# Altium project Sayma_AMC.PrjPcb (part 17 of 18)
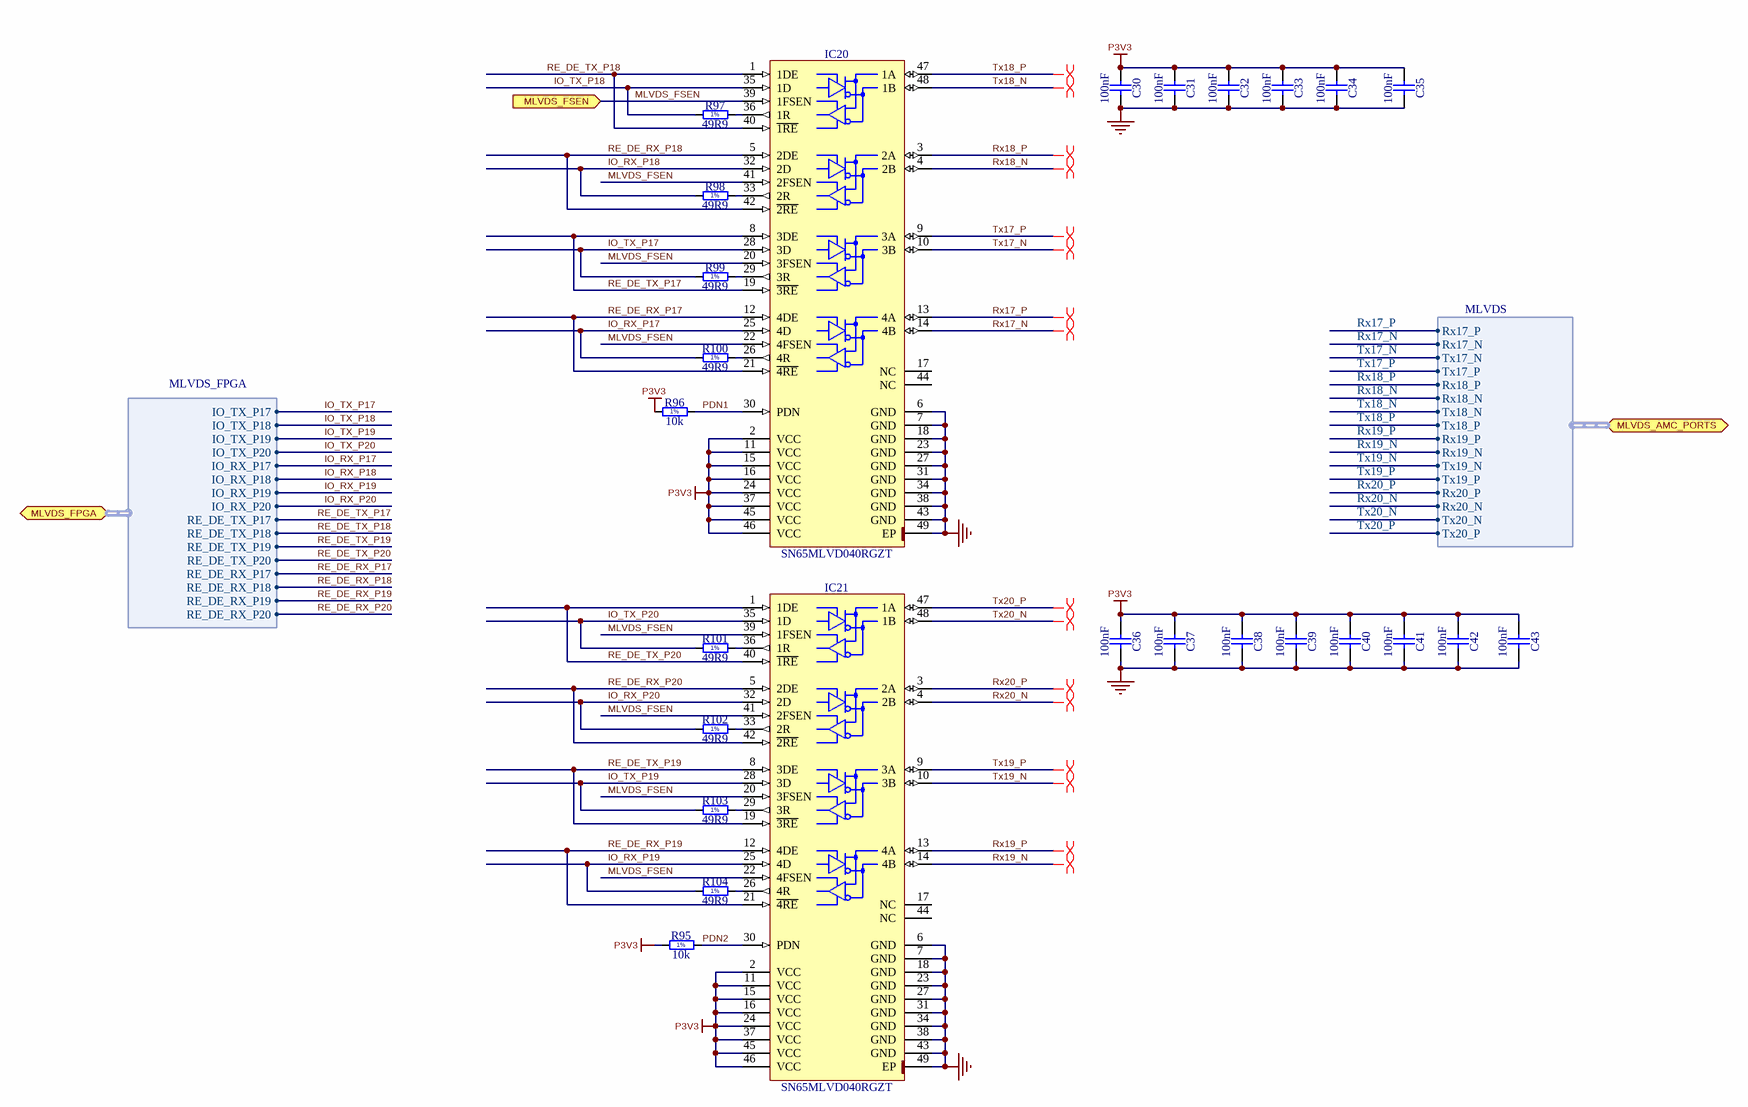
[diagram p32: M-LVDS_PHY.SchDoc]
## Nets that join several sheets
GND: Sayma_AMC (38 pins), USB_SERIAL_QUAD (51 pins), AMC_Connector (56 pins), SDRAM_DDR3_4x16 (177 pins), JTAG_Configuration (32 pins), FMC_connector (175 pins), SDRAM_DDR3_2x16 (101 pins), POWER_Management (39 pins), PWR_DC_DC_EXAR (57 pins), QUAD_BUCK (40 pins), PWR_0V9_20A (24 pins), RTM_CON (61 pins), SFP (28 pins), ETH_PHY_RGMII (33 pins), SI5324_CDR_WR_oscillators (80 pins), DDMTD (13 pins), I2C_MUX (7 pins), Thermometers (23 pins), CPU_LPC1776 (18 pins), DUAL_IO_TTL_BUFFER (6 pins), SFP (28 pins), CPU_LPC1776_SUP_PROG (41 pins), FPGA_Banks_44_45_46_DDR64 (7 pins), FPGA_Banks_47_48_HP_FMC (6 pins), FPGA_Banks_64_65_HR (5 pins), FPGA_Banks_67_68_DDR32 (R319.1 R320.1), FPGA_Bank_0_CFG (27 pins), FPGA_Decoupling (124 pins), FPGA_GND_NC (271 pins), FPGA_Bank_66_HP (R323.1), FPGA_Power (18 pins), FPGA_Banks_224_225_226_227_228 (20 pins), M-LVDS_PHY (34 pins)
MGTAVCC: PWR_DC_DC_EXAR (L27.2 L32.2), FPGA_Decoupling (27 pins), FPGA_Power (14 pins)
MGTAVTT: PWR_DC_DC_EXAR (L26.2), FPGA_Bank_0_CFG (IC37.AP6 R527.2), FPGA_Decoupling (22 pins), FPGA_Power (16 pins)
MGTVCCAUX: PWR_DC_DC_EXAR (L24.1), FPGA_Decoupling (5 pins), FPGA_Power (IC37.AA6 IC37.R6)
P1V5: SDRAM_DDR3_4x16 (131 pins), SDRAM_DDR3_2x16 (67 pins), PWR_DC_DC_EXAR (5 pins), FPGA_Banks_44_45_46_DDR64 (R260.1 R261.1 R262.1 R263.1), FPGA_Decoupling (13 pins), FPGA_Power (33 pins)
P1V8: FMC_connector (7 pins), PWR_DC_DC_EXAR (6 pins), FPGA_Banks_47_48_HP_FMC (R290.1), FPGA_Bank_0_CFG (R575.1), FPGA_Decoupling (8 pins), FPGA_Power (21 pins)
P3V3: USB_SERIAL_QUAD (7 pins), SDRAM_DDR3_4x16 (C431.1 IC28.7 IC28.10), JTAG_Configuration (17 pins), SDRAM_DDR3_2x16 (C444.1 IC29.7 IC29.10), POWER_Management (R524.1), PWR_DC_DC_EXAR (L28.2 L34.2 R506.2 TP11.1), SFP (16 pins), ETH_PHY_RGMII (9 pins), SI5324_CDR_WR_oscillators (R313.1 R381.1), I2C_MUX (13 pins), DUAL_IO_TTL_BUFFER (C402.1 IC52.14 R448.2 R449.2), SFP (16 pins), FPGA_Banks_64_65_HR (C258.2 J18.11 OSC3.1 OSC3.4), FPGA_Bank_0_CFG (21 pins), FPGA_Decoupling (7 pins), FPGA_Power (15 pins), FPGA_Banks_224_225_226_227_228 (L14.2 L15.2), M-LVDS_PHY (32 pins)
P3V3_CLK: SI5324_CDR_WR_oscillators (7 pins), DDMTD (L7.1)
P3V3_FMC: FMC_connector (6 pins), PWR_DC_DC_EXAR (6 pins)
P3V3MP: USB_SERIAL_QUAD (IC8.1 R517.1 R518.2), AMC_Connector (J5.4), JTAG_Configuration (5 pins), POWER_Management (15 pins), PWR_DC_DC_EXAR (7 pins), QUAD_BUCK (R557.2), PWR_0V9_20A (R512.2), I2C_MUX (8 pins), Thermometers (20 pins), CPU_LPC1776 (27 pins), CPU_LPC1776_SUP_PROG (39 pins), FPGA_Bank_0_CFG (C216.2 IC35.14)
P3V3MP_RTM: POWER_Management (F2.2), RTM_CON (J11.c2)
P5V0: PWR_DC_DC_EXAR (8 pins), QUAD_BUCK (R556.2), SI5324_CDR_WR_oscillators (L17.1)
P12V0: POWER_Management (22 pins), PWR_DC_DC_EXAR (11 pins), QUAD_BUCK (10 pins), PWR_0V9_20A (15 pins)
P12V0_RTM: POWER_Management (IC56.2 R86.2 R523.2), RTM_CON (J11.a1 J11.a2 J11.b1 J11.b2)
PAYLOAD_PWR: AMC_Connector (8 pins), POWER_Management (5 pins)
VCCAUX: PWR_DC_DC_EXAR (L30.2), FPGA_Decoupling (6 pins), FPGA_Power (15 pins)
VCCBRAM: PWR_DC_DC_EXAR (L25.2 R554.2), FPGA_Decoupling (10 pins), FPGA_Power (IC37.AA18 IC37.AB17 IC37.V17 IC37.Y17)
VCCINT: PWR_DC_DC_EXAR (R554.1 TP13.1), PWR_0V9_20A (R187.2 R507.1 R515.1 R536.2), FPGA_Decoupling (26 pins), FPGA_Power (49 pins)
VTT32: SDRAM_DDR3_2x16 (43 pins), FPGA_Banks_67_68_DDR32 (6 pins)
VTT64: SDRAM_DDR3_4x16 (43 pins), FPGA_Banks_44_45_46_DDR64 (12 pins)
AMC_En: AMC_Connector (J5.41), CPU_LPC1776 (R404.1 R414.1), CPU_LPC1776_SUP_PROG (D29.1 R434.1 T18.1)
AMC_TCK: AMC_Connector (J5.165), JTAG_Configuration (D18.1 IC5.9 R57.2)
AMC_TDI: AMC_Connector (J5.169), JTAG_Configuration (D16.1 IC5.4 R56.2)
AMC_TDO: AMC_Connector (J5.168), JTAG_Configuration (D19.1 IC5.7 R55.2)
AMC_TMS: AMC_Connector (J5.166), JTAG_Configuration (D17.1 IC5.12 R54.2)
AMC_TRSTn: AMC_Connector (J5.167), JTAG_Configuration (D4.1 D22.1 R47.2 R63.2)
ARX0_N: ETH_PHY_RGMII (C183.2), FPGA_Banks_224_225_226_227_228 (C335.2)
ARX0_P: ETH_PHY_RGMII (C182.2), FPGA_Banks_224_225_226_227_228 (C336.2)
ATX0_N: ETH_PHY_RGMII (C185.2), FPGA_Banks_224_225_226_227_228 (C333.2)
ATX0_P: ETH_PHY_RGMII (C184.2), FPGA_Banks_224_225_226_227_228 (C334.2)
AUX_UART_RxD: USB_SERIAL_QUAD (R16.1), FPGA_Banks_64_65_HR (IC37.L27)
AUX_UART_TxD: USB_SERIAL_QUAD (R15.1), FPGA_Banks_64_65_HR (IC37.M27)
BOOT_MODE0: CPU_LPC1776 (IC51.P9), FPGA_Bank_0_CFG (R248.2)
BOOT_MODE1: CPU_LPC1776 (IC51.P11), FPGA_Bank_0_CFG (R247.2)
BOOT_MODE2: CPU_LPC1776 (IC51.P3), FPGA_Bank_0_CFG (R246.2)
BOOT_MODE3: CPU_LPC1776 (IC51.N5), FPGA_Bank_0_CFG (R251.2)
CDR_CLK_CLEAN0_N: SI5324_CDR_WR_oscillators (C358.2), FPGA_Bank_66_HP (IC37.G12 R325.2)
CDR_CLK_CLEAN0_P: SI5324_CDR_WR_oscillators (C362.2), FPGA_Bank_66_HP (IC37.H12 R324.2)
CDR_CLK_CLEAN1_N: SI5324_CDR_WR_oscillators (C359.2), FPGA_Banks_224_225_226_227_228 (IC37.AF5)
CDR_CLK_CLEAN1_P: SI5324_CDR_WR_oscillators (C361.2), FPGA_Banks_224_225_226_227_228 (IC37.AF6)
CDR_CLK_CLEAN2_N: SI5324_CDR_WR_oscillators (C274.2), FPGA_Banks_224_225_226_227_228 (IC37.Y5)
CDR_CLK_CLEAN2_P: SI5324_CDR_WR_oscillators (C1.2), FPGA_Banks_224_225_226_227_228 (IC37.Y6)
CDR_CLK_CLEAN3_N: SI5324_CDR_WR_oscillators (C448.2), FPGA_Banks_224_225_226_227_228 (IC37.P5)
CDR_CLK_CLEAN3_P: SI5324_CDR_WR_oscillators (C407.2), FPGA_Banks_224_225_226_227_228 (IC37.P6)
CLK0_M2C_N: FMC_connector (J8.h5), FPGA_Banks_47_48_HP_FMC (IC37.AA25)
CLK0_M2C_P: FMC_connector (J8.h4), FPGA_Banks_47_48_HP_FMC (IC37.AA24)
CLK1_M2C_N: FMC_connector (J8.g3), FPGA_Banks_47_48_HP_FMC (IC37.AC32)
CLK1_M2C_P: FMC_connector (J8.g2), FPGA_Banks_47_48_HP_FMC (IC37.AC31)
CLK_DIR: FMC_connector (J8.b1), CPU_LPC1776 (R438.1 R439.1)
CLK_SEL: SI5324_CDR_WR_oscillators (IC44.32), FPGA_Banks_64_65_HR (IC37.N23)
DDMTD_OUT_CDR_CLK_N: DDMTD (R345.2 R539.1), FPGA_Banks_67_68_DDR32 (IC37.B16 R543.2 R544.2)
DDMTD_OUT_CDR_CLK_P: DDMTD (R344.2 R538.2), FPGA_Banks_67_68_DDR32 (IC37.B17 R542.2 R543.1)
DDMTD_OUT_CDR_CLK_SSTL18: DDMTD (C674.1 R569.1 R570.2), FPGA_Bank_66_HP (IC37.F12)
DDMTD_OUT_MAIN_CLK_N: DDMTD (R526.2 R541.1), FPGA_Banks_67_68_DDR32 (IC37.A15 R546.2 R547.2)
DDMTD_OUT_MAIN_CLK_P: DDMTD (R494.2 R540.2), FPGA_Banks_67_68_DDR32 (IC37.B15 R545.2 R546.1)
DDMTD_OUT_MAIN_CLK_SSTL18: DDMTD (C675.1 R573.1 R574.2), FPGA_Bank_66_HP (IC37.L9)
DDR3_32_A0: SDRAM_DDR3_2x16 (IC26.N3 IC27.N3 R164.2), FPGA_Banks_67_68_DDR32 (IC37.E15)
DDR3_32_A1: SDRAM_DDR3_2x16 (IC26.P7 IC27.P7 R163.2), FPGA_Banks_67_68_DDR32 (IC37.D15)
DDR3_32_A2: SDRAM_DDR3_2x16 (IC26.P3 IC27.P3 R162.2), FPGA_Banks_67_68_DDR32 (IC37.J16)
DDR3_32_A3: SDRAM_DDR3_2x16 (IC26.N2 IC27.N2 R168.2), FPGA_Banks_67_68_DDR32 (IC37.K18)
DDR3_32_A4: SDRAM_DDR3_2x16 (IC26.P8 IC27.P8 R167.2), FPGA_Banks_67_68_DDR32 (IC37.H16)
DDR3_32_A5: SDRAM_DDR3_2x16 (IC26.P2 IC27.P2 R166.2), FPGA_Banks_67_68_DDR32 (IC37.K17)
DDR3_32_A6: SDRAM_DDR3_2x16 (IC26.R8 IC27.R8 R165.2), FPGA_Banks_67_68_DDR32 (IC37.K16)
DDR3_32_A7: SDRAM_DDR3_2x16 (IC26.R2 IC27.R2 R161.2), FPGA_Banks_67_68_DDR32 (IC37.J15)
DDR3_32_A8: SDRAM_DDR3_2x16 (IC26.T8 IC27.T8 R160.2), FPGA_Banks_67_68_DDR32 (IC37.K15)
DDR3_32_A9: SDRAM_DDR3_2x16 (IC26.R3 IC27.R3 R159.2), FPGA_Banks_67_68_DDR32 (IC37.D14)
DDR3_32_A10: SDRAM_DDR3_2x16 (IC26.L7 IC27.L7 R158.2), FPGA_Banks_67_68_DDR32 (IC37.D18)
DDR3_32_A11: SDRAM_DDR3_2x16 (IC26.R7 IC27.R7 R157.2), FPGA_Banks_67_68_DDR32 (IC37.G15)
DDR3_32_A12: SDRAM_DDR3_2x16 (IC26.N7 IC27.N7 R156.2), FPGA_Banks_67_68_DDR32 (IC37.L18)
DDR3_32_A13: SDRAM_DDR3_2x16 (IC26.T3 IC27.T3 R155.2), FPGA_Banks_67_68_DDR32 (IC37.G14)
DDR3_32_A14: SDRAM_DDR3_2x16 (IC26.T7 IC27.T7 R170.2), FPGA_Banks_67_68_DDR32 (IC37.L15)
DDR3_32_BA0: SDRAM_DDR3_2x16 (IC26.M2 IC27.M2 R146.2), FPGA_Banks_67_68_DDR32 (IC37.L19)
DDR3_32_BA1: SDRAM_DDR3_2x16 (IC26.N8 IC27.N8 R145.2), FPGA_Banks_67_68_DDR32 (IC37.H17)
DDR3_32_BA2: SDRAM_DDR3_2x16 (IC26.M3 IC27.M3 R144.2), FPGA_Banks_67_68_DDR32 (IC37.G16)
DDR3_32_CAS_N: SDRAM_DDR3_2x16 (IC26.K3 IC27.K3 R150.2), FPGA_Banks_67_68_DDR32 (IC37.E16)
DDR3_32_CK_N: SDRAM_DDR3_2x16 (IC26.K7 IC27.K7 R153.2), FPGA_Banks_67_68_DDR32 (IC37.J18)
DDR3_32_CK_P: SDRAM_DDR3_2x16 (IC26.J7 IC27.J7 R154.2), FPGA_Banks_67_68_DDR32 (IC37.J19)
DDR3_32_CKE: SDRAM_DDR3_2x16 (IC26.K9 IC27.K9 R152.2), FPGA_Banks_67_68_DDR32 (IC37.H18)
DDR3_32_CS_N: SDRAM_DDR3_2x16 (IC26.L2 IC27.L2 R149.2), FPGA_Banks_67_68_DDR32 (IC37.G19)
DDR3_32_DM0: SDRAM_DDR3_2x16 (IC26.E7), FPGA_Banks_67_68_DDR32 (IC37.F27)
DDR3_32_DM1: SDRAM_DDR3_2x16 (IC26.D3), FPGA_Banks_67_68_DDR32 (IC37.E26)
DDR3_32_DM2: SDRAM_DDR3_2x16 (IC27.E7), FPGA_Banks_67_68_DDR32 (IC37.D23)
DDR3_32_DM3: SDRAM_DDR3_2x16 (IC27.D3), FPGA_Banks_67_68_DDR32 (IC37.G24)
DDR3_32_DQ0: SDRAM_DDR3_2x16 (IC26.E3), FPGA_Banks_67_68_DDR32 (IC37.C28)
DDR3_32_DQ1: SDRAM_DDR3_2x16 (IC26.F7), FPGA_Banks_67_68_DDR32 (IC37.B27)
DDR3_32_DQ2: SDRAM_DDR3_2x16 (IC26.F2), FPGA_Banks_67_68_DDR32 (IC37.A27)
DDR3_32_DQ3: SDRAM_DDR3_2x16 (IC26.F8), FPGA_Banks_67_68_DDR32 (IC37.C27)
DDR3_32_DQ4: SDRAM_DDR3_2x16 (IC26.H3), FPGA_Banks_67_68_DDR32 (IC37.D28)
DDR3_32_DQ5: SDRAM_DDR3_2x16 (IC26.H8), FPGA_Banks_67_68_DDR32 (IC37.E28)
DDR3_32_DQ6: SDRAM_DDR3_2x16 (IC26.G2), FPGA_Banks_67_68_DDR32 (IC37.A28)
DDR3_32_DQ7: SDRAM_DDR3_2x16 (IC26.H7), FPGA_Banks_67_68_DDR32 (IC37.D29)
DDR3_32_DQ8: SDRAM_DDR3_2x16 (IC26.D7), FPGA_Banks_67_68_DDR32 (IC37.D25)
DDR3_32_DQ9: SDRAM_DDR3_2x16 (IC26.C3), FPGA_Banks_67_68_DDR32 (IC37.C26)
DDR3_32_DQ10: SDRAM_DDR3_2x16 (IC26.C8), FPGA_Banks_67_68_DDR32 (IC37.E25)
DDR3_32_DQ11: SDRAM_DDR3_2x16 (IC26.C2), FPGA_Banks_67_68_DDR32 (IC37.B25)
DDR3_32_DQ12: SDRAM_DDR3_2x16 (IC26.A7), FPGA_Banks_67_68_DDR32 (IC37.C24)
DDR3_32_DQ13: SDRAM_DDR3_2x16 (IC26.A2), FPGA_Banks_67_68_DDR32 (IC37.A25)
DDR3_32_DQ14: SDRAM_DDR3_2x16 (IC26.B8), FPGA_Banks_67_68_DDR32 (IC37.D24)
DDR3_32_DQ15: SDRAM_DDR3_2x16 (IC26.A3), FPGA_Banks_67_68_DDR32 (IC37.B26)
DDR3_32_DQ16: SDRAM_DDR3_2x16 (IC27.E3), FPGA_Banks_67_68_DDR32 (IC37.B20)
DDR3_32_DQ17: SDRAM_DDR3_2x16 (IC27.F7), FPGA_Banks_67_68_DDR32 (IC37.D21)
DDR3_32_DQ18: SDRAM_DDR3_2x16 (IC27.F2), FPGA_Banks_67_68_DDR32 (IC37.B22)
DDR3_32_DQ19: SDRAM_DDR3_2x16 (IC27.F8), FPGA_Banks_67_68_DDR32 (IC37.E23)
DDR3_32_DQ20: SDRAM_DDR3_2x16 (IC27.H3), FPGA_Banks_67_68_DDR32 (IC37.E22)
DDR3_32_DQ21: SDRAM_DDR3_2x16 (IC27.H8), FPGA_Banks_67_68_DDR32 (IC37.D20)
DDR3_32_DQ22: SDRAM_DDR3_2x16 (IC27.G2), FPGA_Banks_67_68_DDR32 (IC37.B21)
DDR3_32_DQ23: SDRAM_DDR3_2x16 (IC27.H7), FPGA_Banks_67_68_DDR32 (IC37.A20)
DDR3_32_DQ24: SDRAM_DDR3_2x16 (IC27.D7), FPGA_Banks_67_68_DDR32 (IC37.F23)
DDR3_32_DQ25: SDRAM_DDR3_2x16 (IC27.C3), FPGA_Banks_67_68_DDR32 (IC37.H21)
DDR3_32_DQ26: SDRAM_DDR3_2x16 (IC27.C8), FPGA_Banks_67_68_DDR32 (IC37.F24)
DDR3_32_DQ27: SDRAM_DDR3_2x16 (IC27.C2), FPGA_Banks_67_68_DDR32 (IC37.G21)
DDR3_32_DQ28: SDRAM_DDR3_2x16 (IC27.A7), FPGA_Banks_67_68_DDR32 (IC37.F22)
DDR3_32_DQ29: SDRAM_DDR3_2x16 (IC27.A2), FPGA_Banks_67_68_DDR32 (IC37.E21)
DDR3_32_DQ30: SDRAM_DDR3_2x16 (IC27.B8), FPGA_Banks_67_68_DDR32 (IC37.G22)
DDR3_32_DQ31: SDRAM_DDR3_2x16 (IC27.A3), FPGA_Banks_67_68_DDR32 (IC37.E20)
DDR3_32_DQS0_N: SDRAM_DDR3_2x16 (IC26.G3), FPGA_Banks_67_68_DDR32 (IC37.A29)
DDR3_32_DQS0_P: SDRAM_DDR3_2x16 (IC26.F3), FPGA_Banks_67_68_DDR32 (IC37.B29)
DDR3_32_DQS1_N: SDRAM_DDR3_2x16 (IC26.B7), FPGA_Banks_67_68_DDR32 (IC37.A24)
DDR3_32_DQS1_P: SDRAM_DDR3_2x16 (IC26.C7), FPGA_Banks_67_68_DDR32 (IC37.B24)
DDR3_32_DQS2_N: SDRAM_DDR3_2x16 (IC27.G3), FPGA_Banks_67_68_DDR32 (IC37.C22)
DDR3_32_DQS2_P: SDRAM_DDR3_2x16 (IC27.F3), FPGA_Banks_67_68_DDR32 (IC37.C21)
DDR3_32_DQS3_N: SDRAM_DDR3_2x16 (IC27.B7), FPGA_Banks_67_68_DDR32 (IC37.F20)
DDR3_32_DQS3_P: SDRAM_DDR3_2x16 (IC27.C7), FPGA_Banks_67_68_DDR32 (IC37.G20)
DDR3_32_ODT: SDRAM_DDR3_2x16 (IC26.K1 IC27.K1 R147.2), FPGA_Banks_67_68_DDR32 (IC37.F19)
DDR3_32_RAS_N: SDRAM_DDR3_2x16 (IC26.J3 IC27.J3 R151.2), FPGA_Banks_67_68_DDR32 (IC37.E18)
DDR3_32_RST_N: SDRAM_DDR3_2x16 (IC26.T2 IC27.T2 R169.2), FPGA_Banks_67_68_DDR32 (IC37.F14)
DDR3_32_WE_N: SDRAM_DDR3_2x16 (IC26.L3 IC27.L3 R148.2), FPGA_Banks_67_68_DDR32 (IC37.D16)
DDR3_64_A0: SDRAM_DDR3_4x16 (5 pins), FPGA_Banks_44_45_46_DDR64 (IC37.AE17)
DDR3_64_A1: SDRAM_DDR3_4x16 (5 pins), FPGA_Banks_44_45_46_DDR64 (IC37.AL17)
DDR3_64_A2: SDRAM_DDR3_4x16 (5 pins), FPGA_Banks_44_45_46_DDR64 (IC37.AG16)
DDR3_64_A3: SDRAM_DDR3_4x16 (5 pins), FPGA_Banks_44_45_46_DDR64 (IC37.AG17)
DDR3_64_A4: SDRAM_DDR3_4x16 (5 pins), FPGA_Banks_44_45_46_DDR64 (IC37.AD16)
DDR3_64_A5: SDRAM_DDR3_4x16 (5 pins), FPGA_Banks_44_45_46_DDR64 (IC37.AH14)
DDR3_64_A6: SDRAM_DDR3_4x16 (5 pins), FPGA_Banks_44_45_46_DDR64 (IC37.AD15)
DDR3_64_A7: SDRAM_DDR3_4x16 (5 pins), FPGA_Banks_44_45_46_DDR64 (IC37.AK15)
DDR3_64_A8: SDRAM_DDR3_4x16 (5 pins), FPGA_Banks_44_45_46_DDR64 (IC37.AF14)
DDR3_64_A9: SDRAM_DDR3_4x16 (5 pins), FPGA_Banks_44_45_46_DDR64 (IC37.AF15)
DDR3_64_A10: SDRAM_DDR3_4x16 (5 pins), FPGA_Banks_44_45_46_DDR64 (IC37.AL18)
DDR3_64_A11: SDRAM_DDR3_4x16 (5 pins), FPGA_Banks_44_45_46_DDR64 (IC37.AL15)
DDR3_64_A12: SDRAM_DDR3_4x16 (5 pins), FPGA_Banks_44_45_46_DDR64 (IC37.AE18)
DDR3_64_A13: SDRAM_DDR3_4x16 (5 pins), FPGA_Banks_44_45_46_DDR64 (IC37.AJ15)
DDR3_64_A14: SDRAM_DDR3_4x16 (5 pins), FPGA_Banks_44_45_46_DDR64 (IC37.AG14)
DDR3_64_BA0: SDRAM_DDR3_4x16 (5 pins), FPGA_Banks_44_45_46_DDR64 (IC37.AF17)
DDR3_64_BA1: SDRAM_DDR3_4x16 (5 pins), FPGA_Banks_44_45_46_DDR64 (IC37.AD19)
DDR3_64_BA2: SDRAM_DDR3_4x16 (5 pins), FPGA_Banks_44_45_46_DDR64 (IC37.AD18)
DDR3_64_CAS_N: SDRAM_DDR3_4x16 (5 pins), FPGA_Banks_44_45_46_DDR64 (IC37.AK18)
DDR3_64_CK_N: SDRAM_DDR3_4x16 (5 pins), FPGA_Banks_44_45_46_DDR64 (IC37.AE15)
DDR3_64_CK_P: SDRAM_DDR3_4x16 (5 pins), FPGA_Banks_44_45_46_DDR64 (IC37.AE16)
DDR3_64_CKE: SDRAM_DDR3_4x16 (5 pins), FPGA_Banks_44_45_46_DDR64 (IC37.AL19)
DDR3_64_CS_N: SDRAM_DDR3_4x16 (5 pins), FPGA_Banks_44_45_46_DDR64 (IC37.AF18)
DDR3_64_DM0: SDRAM_DDR3_4x16 (IC22.E7), FPGA_Banks_44_45_46_DDR64 (IC37.AD21)
DDR3_64_DM1: SDRAM_DDR3_4x16 (IC22.D3), FPGA_Banks_44_45_46_DDR64 (IC37.AE25)
DDR3_64_DM2: SDRAM_DDR3_4x16 (IC23.E7), FPGA_Banks_44_45_46_DDR64 (IC37.AJ21)
DDR3_64_DM3: SDRAM_DDR3_4x16 (IC23.D3), FPGA_Banks_44_45_46_DDR64 (IC37.AM21)
DDR3_64_DM4: SDRAM_DDR3_4x16 (IC4.E7), FPGA_Banks_44_45_46_DDR64 (IC37.AH26)
DDR3_64_DM5: SDRAM_DDR3_4x16 (IC4.D3), FPGA_Banks_44_45_46_DDR64 (IC37.AN26)
DDR3_64_DM6: SDRAM_DDR3_4x16 (IC25.E7), FPGA_Banks_44_45_46_DDR64 (IC37.AJ29)
DDR3_64_DM7: SDRAM_DDR3_4x16 (IC25.D3), FPGA_Banks_44_45_46_DDR64 (IC37.AL32)
DDR3_64_DQ0: SDRAM_DDR3_4x16 (IC22.E3), FPGA_Banks_44_45_46_DDR64 (IC37.AE23)
DDR3_64_DQ1: SDRAM_DDR3_4x16 (IC22.F7), FPGA_Banks_44_45_46_DDR64 (IC37.AG20)
DDR3_64_DQ2: SDRAM_DDR3_4x16 (IC22.F2), FPGA_Banks_44_45_46_DDR64 (IC37.AF22)
DDR3_64_DQ3: SDRAM_DDR3_4x16 (IC22.F8), FPGA_Banks_44_45_46_DDR64 (IC37.AF20)
DDR3_64_DQ4: SDRAM_DDR3_4x16 (IC22.H3), FPGA_Banks_44_45_46_DDR64 (IC37.AE22)
DDR3_64_DQ5: SDRAM_DDR3_4x16 (IC22.H8), FPGA_Banks_44_45_46_DDR64 (IC37.AD20)
DDR3_64_DQ6: SDRAM_DDR3_4x16 (IC22.G2), FPGA_Banks_44_45_46_DDR64 (IC37.AG22)
DDR3_64_DQ7: SDRAM_DDR3_4x16 (IC22.H7), FPGA_Banks_44_45_46_DDR64 (IC37.AE20)
DDR3_64_DQ8: SDRAM_DDR3_4x16 (IC22.D7), FPGA_Banks_44_45_46_DDR64 (IC37.AJ24)
DDR3_64_DQ9: SDRAM_DDR3_4x16 (IC22.C3), FPGA_Banks_44_45_46_DDR64 (IC37.AG24)
DDR3_64_DQ10: SDRAM_DDR3_4x16 (IC22.C8), FPGA_Banks_44_45_46_DDR64 (IC37.AJ23)
DDR3_64_DQ11: SDRAM_DDR3_4x16 (IC22.C2), FPGA_Banks_44_45_46_DDR64 (IC37.AF23)
DDR3_64_DQ12: SDRAM_DDR3_4x16 (IC22.A7), FPGA_Banks_44_45_46_DDR64 (IC37.AH23)
DDR3_64_DQ13: SDRAM_DDR3_4x16 (IC22.A2), FPGA_Banks_44_45_46_DDR64 (IC37.AF24)
DDR3_64_DQ14: SDRAM_DDR3_4x16 (IC22.B8), FPGA_Banks_44_45_46_DDR64 (IC37.AH22)
DDR3_64_DQ15: SDRAM_DDR3_4x16 (IC22.A3), FPGA_Banks_44_45_46_DDR64 (IC37.AG25)
DDR3_64_DQ16: SDRAM_DDR3_4x16 (IC23.E3), FPGA_Banks_44_45_46_DDR64 (IC37.AL22)
DDR3_64_DQ17: SDRAM_DDR3_4x16 (IC23.F7), FPGA_Banks_44_45_46_DDR64 (IC37.AL25)
DDR3_64_DQ18: SDRAM_DDR3_4x16 (IC23.F2), FPGA_Banks_44_45_46_DDR64 (IC37.AM20)
DDR3_64_DQ19: SDRAM_DDR3_4x16 (IC23.F8), FPGA_Banks_44_45_46_DDR64 (IC37.AK23)
DDR3_64_DQ20: SDRAM_DDR3_4x16 (IC23.H3), FPGA_Banks_44_45_46_DDR64 (IC37.AK22)
DDR3_64_DQ21: SDRAM_DDR3_4x16 (IC23.H8), FPGA_Banks_44_45_46_DDR64 (IC37.AL24)
DDR3_64_DQ22: SDRAM_DDR3_4x16 (IC23.G2), FPGA_Banks_44_45_46_DDR64 (IC37.AL20)
DDR3_64_DQ23: SDRAM_DDR3_4x16 (IC23.H7), FPGA_Banks_44_45_46_DDR64 (IC37.AL23)
DDR3_64_DQ24: SDRAM_DDR3_4x16 (IC23.D7), FPGA_Banks_44_45_46_DDR64 (IC37.AM24)
DDR3_64_DQ25: SDRAM_DDR3_4x16 (IC23.C3), FPGA_Banks_44_45_46_DDR64 (IC37.AN23)
DDR3_64_DQ26: SDRAM_DDR3_4x16 (IC23.C8), FPGA_Banks_44_45_46_DDR64 (IC37.AN24)
DDR3_64_DQ27: SDRAM_DDR3_4x16 (IC23.C2), FPGA_Banks_44_45_46_DDR64 (IC37.AP23)
DDR3_64_DQ28: SDRAM_DDR3_4x16 (IC23.A7), FPGA_Banks_44_45_46_DDR64 (IC37.AP25)
DDR3_64_DQ29: SDRAM_DDR3_4x16 (IC23.A2), FPGA_Banks_44_45_46_DDR64 (IC37.AN22)
DDR3_64_DQ30: SDRAM_DDR3_4x16 (IC23.B8), FPGA_Banks_44_45_46_DDR64 (IC37.AP24)
DDR3_64_DQ31: SDRAM_DDR3_4x16 (IC23.A3), FPGA_Banks_44_45_46_DDR64 (IC37.AM22)
DDR3_64_DQ32: SDRAM_DDR3_4x16 (IC4.E3), FPGA_Banks_44_45_46_DDR64 (IC37.AH28)
DDR3_64_DQ33: SDRAM_DDR3_4x16 (IC4.F7), FPGA_Banks_44_45_46_DDR64 (IC37.AK26)
DDR3_64_DQ34: SDRAM_DDR3_4x16 (IC4.F2), FPGA_Banks_44_45_46_DDR64 (IC37.AK28)
DDR3_64_DQ35: SDRAM_DDR3_4x16 (IC4.F8), FPGA_Banks_44_45_46_DDR64 (IC37.AM27)
DDR3_64_DQ36: SDRAM_DDR3_4x16 (IC4.H3), FPGA_Banks_44_45_46_DDR64 (IC37.AJ28)
DDR3_64_DQ37: SDRAM_DDR3_4x16 (IC4.H8), FPGA_Banks_44_45_46_DDR64 (IC37.AH27)
DDR3_64_DQ38: SDRAM_DDR3_4x16 (IC4.G2), FPGA_Banks_44_45_46_DDR64 (IC37.AK27)
DDR3_64_DQ39: SDRAM_DDR3_4x16 (IC4.H7), FPGA_Banks_44_45_46_DDR64 (IC37.AM26)
DDR3_64_DQ40: SDRAM_DDR3_4x16 (IC4.D7), FPGA_Banks_44_45_46_DDR64 (IC37.AL30)
DDR3_64_DQ41: SDRAM_DDR3_4x16 (IC4.C3), FPGA_Banks_44_45_46_DDR64 (IC37.AP29)
DDR3_64_DQ42: SDRAM_DDR3_4x16 (IC4.C8), FPGA_Banks_44_45_46_DDR64 (IC37.AM30)
DDR3_64_DQ43: SDRAM_DDR3_4x16 (IC4.C2), FPGA_Banks_44_45_46_DDR64 (IC37.AN28)
DDR3_64_DQ44: SDRAM_DDR3_4x16 (IC4.A7), FPGA_Banks_44_45_46_DDR64 (IC37.AL29)
DDR3_64_DQ45: SDRAM_DDR3_4x16 (IC4.A2), FPGA_Banks_44_45_46_DDR64 (IC37.AP28)
DDR3_64_DQ46: SDRAM_DDR3_4x16 (IC4.B8), FPGA_Banks_44_45_46_DDR64 (IC37.AM29)
DDR3_64_DQ47: SDRAM_DDR3_4x16 (IC4.A3), FPGA_Banks_44_45_46_DDR64 (IC37.AN27)
DDR3_64_DQ48: SDRAM_DDR3_4x16 (IC25.E3), FPGA_Banks_44_45_46_DDR64 (IC37.AH31)
DDR3_64_DQ49: SDRAM_DDR3_4x16 (IC25.F7), FPGA_Banks_44_45_46_DDR64 (IC37.AH32)
DDR3_64_DQ50: SDRAM_DDR3_4x16 (IC25.F2), FPGA_Banks_44_45_46_DDR64 (IC37.AJ34)
DDR3_64_DQ51: SDRAM_DDR3_4x16 (IC25.F8), FPGA_Banks_44_45_46_DDR64 (IC37.AK31)
DDR3_64_DQ52: SDRAM_DDR3_4x16 (IC25.H3), FPGA_Banks_44_45_46_DDR64 (IC37.AJ31)
DDR3_64_DQ53: SDRAM_DDR3_4x16 (IC25.H8), FPGA_Banks_44_45_46_DDR64 (IC37.AJ30)
DDR3_64_DQ54: SDRAM_DDR3_4x16 (IC25.G2), FPGA_Banks_44_45_46_DDR64 (IC37.AH34)
DDR3_64_DQ55: SDRAM_DDR3_4x16 (IC25.H7), FPGA_Banks_44_45_46_DDR64 (IC37.AK32)
DDR3_64_DQ56: SDRAM_DDR3_4x16 (IC25.D7), FPGA_Banks_44_45_46_DDR64 (IC37.AN33)
DDR3_64_DQ57: SDRAM_DDR3_4x16 (IC25.C3), FPGA_Banks_44_45_46_DDR64 (IC37.AP33)
DDR3_64_DQ58: SDRAM_DDR3_4x16 (IC25.C8), FPGA_Banks_44_45_46_DDR64 (IC37.AM34)
DDR3_64_DQ59: SDRAM_DDR3_4x16 (IC25.C2), FPGA_Banks_44_45_46_DDR64 (IC37.AP31)
DDR3_64_DQ60: SDRAM_DDR3_4x16 (IC25.A7), FPGA_Banks_44_45_46_DDR64 (IC37.AM32)
DDR3_64_DQ61: SDRAM_DDR3_4x16 (IC25.A2), FPGA_Banks_44_45_46_DDR64 (IC37.AN31)
DDR3_64_DQ62: SDRAM_DDR3_4x16 (IC25.B8), FPGA_Banks_44_45_46_DDR64 (IC37.AL34)
DDR3_64_DQ63: SDRAM_DDR3_4x16 (IC25.A3), FPGA_Banks_44_45_46_DDR64 (IC37.AN32)
DDR3_64_DQS0_N: SDRAM_DDR3_4x16 (IC22.G3), FPGA_Banks_44_45_46_DDR64 (IC37.AH21)
DDR3_64_DQS0_P: SDRAM_DDR3_4x16 (IC22.F3), FPGA_Banks_44_45_46_DDR64 (IC37.AG21)
DDR3_64_DQS1_N: SDRAM_DDR3_4x16 (IC22.B7), FPGA_Banks_44_45_46_DDR64 (IC37.AJ25)
DDR3_64_DQS1_P: SDRAM_DDR3_4x16 (IC22.C7), FPGA_Banks_44_45_46_DDR64 (IC37.AH24)
DDR3_64_DQS2_N: SDRAM_DDR3_4x16 (IC23.G3), FPGA_Banks_44_45_46_DDR64 (IC37.AK20)
DDR3_64_DQS2_P: SDRAM_DDR3_4x16 (IC23.F3), FPGA_Banks_44_45_46_DDR64 (IC37.AJ20)
DDR3_64_DQS3_N: SDRAM_DDR3_4x16 (IC23.B7), FPGA_Banks_44_45_46_DDR64 (IC37.AP21)
DDR3_64_DQS3_P: SDRAM_DDR3_4x16 (IC23.C7), FPGA_Banks_44_45_46_DDR64 (IC37.AP20)
DDR3_64_DQS4_N: SDRAM_DDR3_4x16 (IC4.G3), FPGA_Banks_44_45_46_DDR64 (IC37.AL28)
DDR3_64_DQS4_P: SDRAM_DDR3_4x16 (IC4.F3), FPGA_Banks_44_45_46_DDR64 (IC37.AL27)
DDR3_64_DQS5_N: SDRAM_DDR3_4x16 (IC4.B7), FPGA_Banks_44_45_46_DDR64 (IC37.AP30)
DDR3_64_DQS5_P: SDRAM_DDR3_4x16 (IC4.C7), FPGA_Banks_44_45_46_DDR64 (IC37.AN29)
DDR3_64_DQS6_N: SDRAM_DDR3_4x16 (IC25.G3), FPGA_Banks_44_45_46_DDR64 (IC37.AJ33)
DDR3_64_DQS6_P: SDRAM_DDR3_4x16 (IC25.F3), FPGA_Banks_44_45_46_DDR64 (IC37.AH33)
DDR3_64_DQS7_N: SDRAM_DDR3_4x16 (IC25.B7), FPGA_Banks_44_45_46_DDR64 (IC37.AP34)
DDR3_64_DQS7_P: SDRAM_DDR3_4x16 (IC25.C7), FPGA_Banks_44_45_46_DDR64 (IC37.AN34)
DDR3_64_ODT: SDRAM_DDR3_4x16 (5 pins), FPGA_Banks_44_45_46_DDR64 (IC37.AJ18)
DDR3_64_RAS_N: SDRAM_DDR3_4x16 (5 pins), FPGA_Banks_44_45_46_DDR64 (IC37.AH19)
DDR3_64_RST_N: SDRAM_DDR3_4x16 (5 pins), FPGA_Banks_44_45_46_DDR64 (IC37.AJ14)
DDR3_64_VREF: SDRAM_DDR3_4x16 (18 pins), FPGA_Bank_0_CFG (6 pins)
DDR3_64_WE_N: SDRAM_DDR3_4x16 (5 pins), FPGA_Banks_44_45_46_DDR64 (IC37.AG19)
DDR32_CLK_N: SI5324_CDR_WR_oscillators (C238.2), FPGA_Banks_67_68_DDR32 (IC37.F17 R322.2 R529.2)
DDR32_CLK_P: SI5324_CDR_WR_oscillators (C237.2), FPGA_Banks_67_68_DDR32 (IC37.F18 R321.2 R529.1)
DDR32_VREF: SDRAM_DDR3_2x16 (10 pins), FPGA_Bank_0_CFG (C259.1 C260.1 IC37.J20 IC37.L14)
DDR64_CLK_N: SI5324_CDR_WR_oscillators (C262.2), FPGA_Banks_44_45_46_DDR64 (IC37.AK16 R282.2 R528.2)
DDR64_CLK_P: SI5324_CDR_WR_oscillators (C261.2), FPGA_Banks_44_45_46_DDR64 (IC37.AK17 R281.2 R528.1)
DP0_C2M_N: FMC_connector (J8.c3), FPGA_Banks_44_45_46_DDR64 (C251.2)
DP0_C2M_P: FMC_connector (J8.c2), FPGA_Banks_44_45_46_DDR64 (C250.2)
DP0_M2C_N: FMC_connector (J8.c7), FPGA_Banks_44_45_46_DDR64 (C244.2)
DP0_M2C_P: FMC_connector (J8.c6), FPGA_Banks_44_45_46_DDR64 (C243.2)
DXN: Thermometers (R387.1), FPGA_Bank_0_CFG (IC37.Y11)
DXP: Thermometers (C516.2 C517.2 IC50.3), FPGA_Bank_0_CFG (IC37.Y12)
EN_1V0: QUAD_BUCK (IC33.C6), CPU_LPC1776 (IC51.A14)
EN_1V2: PWR_DC_DC_EXAR (IC59.11 MOD1.2 R481.2), CPU_LPC1776 (IC51.A7)
EN_1V5: QUAD_BUCK (IC33.F6), CPU_LPC1776 (IC51.A8)
EN_1V8: QUAD_BUCK (IC33.K7), CPU_LPC1776 (IC51.D8)
EN_3V3: QUAD_BUCK (IC33.J6), CPU_LPC1776 (IC51.D14)
EN_FLASH_UPDATE: CPU_LPC1776 (IC51.J4), FPGA_Bank_0_CFG (5 pins)
EN_FMC1_P12V: POWER_Management (R74.2 T13.1), CPU_LPC1776 (IC51.M9)
EN_P0V95: PWR_DC_DC_EXAR (IC58.11 MOD1.3 R480.2), CPU_LPC1776 (IC51.A12)
EN_P3V3_FMC: PWR_DC_DC_EXAR (IC34.6 R317.2), CPU_LPC1776 (IC51.C13)
EN_P5V0: PWR_DC_DC_EXAR (IC24.6 R314.2), CPU_LPC1776 (IC51.N10)
EN_PSU_CH: PWR_DC_DC_EXAR (MOD1.6 R488.2), CPU_LPC1776 (IC51.K2)
EN_RTM_MP: POWER_Management (R84.2 T15.1), CPU_LPC1776 (IC51.K3)
EN_RTM_PWR: POWER_Management (R73.2 T14.1), CPU_LPC1776 (IC51.P8)
EN_USB_JTAG: USB_SERIAL_QUAD (T3.1), JTAG_Configuration (5 pins)
EN_VCCINT: PWR_0V9_20A (IC60.2 R513.2), CPU_LPC1776 (IC51.P10)
EXT_CLK_IN_N: SI5324_CDR_WR_oscillators (C681.2 R553.2), FPGA_Banks_47_48_HP_FMC (IC37.AA23 R549.1 R550.1)
EXT_CLK_IN_P: SI5324_CDR_WR_oscillators (C680.2 R552.2), FPGA_Banks_47_48_HP_FMC (IC37.Y23 R548.1 R549.2)
FCLKA_N: AMC_Connector (J5.81), FPGA_Banks_224_225_226_227_228 (C282.2)
FCLKA_P: AMC_Connector (J5.80), FPGA_Banks_224_225_226_227_228 (C281.2)
FLASH_UPD_CLK: CPU_LPC1776 (IC51.K6), FPGA_Bank_0_CFG (IC35.9)
FLASH_UPD_CSB: CPU_LPC1776 (IC51.N6), FPGA_Bank_0_CFG (IC35.2)
FLASH_UPD_MISO: CPU_LPC1776 (IC51.N7), FPGA_Bank_0_CFG (IC35.3)
FLASH_UPD_MOSI: CPU_LPC1776 (IC51.P7), FPGA_Bank_0_CFG (IC35.10)
FMC1_3P3VAUX: FMC_connector (C413.2 C414.2 J8.d32), POWER_Management (F1.2 R524.2)
FMC1_12P0V: FMC_connector (5 pins), POWER_Management (IC55.2 R76.2 R522.2)
FMC1_GBTCLK0_M2C_N: FMC_connector (J8.d5), FPGA_Banks_44_45_46_DDR64 (IC37.AH17 R306.2 R486.2)
FMC1_GBTCLK0_M2C_P: FMC_connector (J8.d4), FPGA_Banks_44_45_46_DDR64 (IC37.AH18 R305.2 R486.1)
FMC1_LA00_CC_N: FMC_connector (J8.g7), FPGA_Banks_47_48_HP_FMC (IC37.AB32)
FMC1_LA00_CC_P: FMC_connector (J8.g6), FPGA_Banks_47_48_HP_FMC (IC37.AA32)
FMC1_LA01_CC_N: FMC_connector (J8.d9), FPGA_Banks_47_48_HP_FMC (IC37.AB31)
FMC1_LA01_CC_P: FMC_connector (J8.d8), FPGA_Banks_47_48_HP_FMC (IC37.AB30)
FMC1_LA02_N: FMC_connector (J8.h8), FPGA_Banks_47_48_HP_FMC (IC37.AG34)
FMC1_LA02_P: FMC_connector (J8.h7), FPGA_Banks_47_48_HP_FMC (IC37.AF33)
FMC1_LA03_N: FMC_connector (J8.g10), FPGA_Banks_47_48_HP_FMC (IC37.W34)
FMC1_LA03_P: FMC_connector (J8.g9), FPGA_Banks_47_48_HP_FMC (IC37.V33)
FMC1_LA04_N: FMC_connector (J8.h11), FPGA_Banks_47_48_HP_FMC (IC37.AG32)
FMC1_LA04_P: FMC_connector (J8.h10), FPGA_Banks_47_48_HP_FMC (IC37.AG31)
FMC1_LA05_N: FMC_connector (J8.d12), FPGA_Banks_47_48_HP_FMC (IC37.AF34)
FMC1_LA05_P: FMC_connector (J8.d11), FPGA_Banks_47_48_HP_FMC (IC37.AE33)
FMC1_LA06_N: FMC_connector (J8.c11), FPGA_Banks_47_48_HP_FMC (IC37.AD34)
FMC1_LA06_P: FMC_connector (J8.c10), FPGA_Banks_47_48_HP_FMC (IC37.AC34)
FMC1_LA07_N: FMC_connector (J8.h14), FPGA_Banks_47_48_HP_FMC (IC37.AD33)
FMC1_LA07_P: FMC_connector (J8.h13), FPGA_Banks_47_48_HP_FMC (IC37.AC33)
FMC1_LA08_N: FMC_connector (J8.g13), FPGA_Banks_47_48_HP_FMC (IC37.AG29)
FMC1_LA08_P: FMC_connector (J8.g12), FPGA_Banks_47_48_HP_FMC (IC37.AF29)
FMC1_LA09_N: FMC_connector (J8.d15), FPGA_Banks_47_48_HP_FMC (IC37.AF32)
FMC1_LA09_P: FMC_connector (J8.d14), FPGA_Banks_47_48_HP_FMC (IC37.AE32)
FMC1_LA10_N: FMC_connector (J8.c15), FPGA_Banks_47_48_HP_FMC (IC37.AB34)
FMC1_LA10_P: FMC_connector (J8.c14), FPGA_Banks_47_48_HP_FMC (IC37.AA34)
FMC1_LA11_N: FMC_connector (J8.h17), FPGA_Banks_47_48_HP_FMC (IC37.AB29)
FMC1_LA11_P: FMC_connector (J8.h16), FPGA_Banks_47_48_HP_FMC (IC37.AA29)
FMC1_LA12_N: FMC_connector (J8.g16), FPGA_Banks_47_48_HP_FMC (IC37.W31)
FMC1_LA12_P: FMC_connector (J8.g15), FPGA_Banks_47_48_HP_FMC (IC37.V31)
FMC1_LA13_N: FMC_connector (J8.d18), FPGA_Banks_47_48_HP_FMC (IC37.Y33)
FMC1_LA13_P: FMC_connector (J8.d17), FPGA_Banks_47_48_HP_FMC (IC37.W33)
FMC1_LA14_N: FMC_connector (J8.c19), FPGA_Banks_47_48_HP_FMC (IC37.V34)
FMC1_LA14_P: FMC_connector (J8.c18), FPGA_Banks_47_48_HP_FMC (IC37.U34)
FMC1_LA15_N: FMC_connector (J8.h20), FPGA_Banks_47_48_HP_FMC (IC37.Y32)
FMC1_LA15_P: FMC_connector (J8.h19), FPGA_Banks_47_48_HP_FMC (IC37.Y31)
FMC1_LA16_N: FMC_connector (J8.g19), FPGA_Banks_47_48_HP_FMC (IC37.Y30)
FMC1_LA16_P: FMC_connector (J8.g18), FPGA_Banks_47_48_HP_FMC (IC37.W30)
FMC1_LA17_CC_N: FMC_connector (J8.d21), FPGA_Banks_47_48_HP_FMC (IC37.W24)
FMC1_LA17_CC_P: FMC_connector (J8.d20), FPGA_Banks_47_48_HP_FMC (IC37.W23)
FMC1_LA18_CC_N: FMC_connector (J8.c23), FPGA_Banks_47_48_HP_FMC (IC37.Y25)
FMC1_LA18_CC_P: FMC_connector (J8.c22), FPGA_Banks_47_48_HP_FMC (IC37.W25)
FMC1_LA19_N: FMC_connector (J8.h23), FPGA_Banks_47_48_HP_FMC (IC37.V23)
FMC1_LA19_P: FMC_connector (J8.h22), FPGA_Banks_47_48_HP_FMC (IC37.V22)
FMC1_LA20_N: FMC_connector (J8.g22), FPGA_Banks_47_48_HP_FMC (IC37.T23)
FMC1_LA20_P: FMC_connector (J8.g21), FPGA_Banks_47_48_HP_FMC (IC37.T22)
FMC1_LA21_N: FMC_connector (J8.h26), FPGA_Banks_47_48_HP_FMC (IC37.W21)
FMC1_LA21_P: FMC_connector (J8.h25), FPGA_Banks_47_48_HP_FMC (IC37.V21)
FMC1_LA22_N: FMC_connector (J8.g25), FPGA_Banks_47_48_HP_FMC (IC37.U22)
FMC1_LA22_P: FMC_connector (J8.g24), FPGA_Banks_47_48_HP_FMC (IC37.U21)
FMC1_LA23_N: FMC_connector (J8.d24), FPGA_Banks_47_48_HP_FMC (IC37.AC21)
FMC1_LA23_P: FMC_connector (J8.d23), FPGA_Banks_47_48_HP_FMC (IC37.AB21)
FMC1_LA24_N: FMC_connector (J8.h29), FPGA_Banks_47_48_HP_FMC (IC37.AC23)
FMC1_LA24_P: FMC_connector (J8.h28), FPGA_Banks_47_48_HP_FMC (IC37.AC22)
FMC1_LA25_N: FMC_connector (J8.g28), FPGA_Banks_47_48_HP_FMC (IC37.AB20)
FMC1_LA25_P: FMC_connector (J8.g27), FPGA_Banks_47_48_HP_FMC (IC37.AA20)
FMC1_LA26_N: FMC_connector (J8.d27), FPGA_Banks_47_48_HP_FMC (IC37.AB22)
FMC1_LA26_P: FMC_connector (J8.d26), FPGA_Banks_47_48_HP_FMC (IC37.AA22)
FMC1_LA27_N: FMC_connector (J8.c27), FPGA_Banks_47_48_HP_FMC (IC37.AB26)
FMC1_LA27_P: FMC_connector (J8.c26), FPGA_Banks_47_48_HP_FMC (IC37.AB25)
FMC1_LA28_N: FMC_connector (J8.h32), FPGA_Banks_47_48_HP_FMC (IC37.W26)
FMC1_LA28_P: FMC_connector (J8.h31), FPGA_Banks_47_48_HP_FMC (IC37.V26)
FMC1_LA29_N: FMC_connector (J8.g31), FPGA_Banks_47_48_HP_FMC (IC37.W29)
FMC1_LA29_P: FMC_connector (J8.g30), FPGA_Banks_47_48_HP_FMC (IC37.V29)
FMC1_LA30_N: FMC_connector (J8.h35), FPGA_Banks_47_48_HP_FMC (IC37.U27)
FMC1_LA30_P: FMC_connector (J8.h34), FPGA_Banks_47_48_HP_FMC (IC37.U26)
FMC1_LA31_N: FMC_connector (J8.g34), FPGA_Banks_47_48_HP_FMC (IC37.Y28)
FMC1_LA31_P: FMC_connector (J8.g33), FPGA_Banks_47_48_HP_FMC (IC37.W28)
FMC1_LA32_N: FMC_connector (J8.h38), FPGA_Banks_47_48_HP_FMC (IC37.U25)
FMC1_LA32_P: FMC_connector (J8.h37), FPGA_Banks_47_48_HP_FMC (IC37.U24)
FMC1_LA33_N: FMC_connector (J8.g37), FPGA_Banks_47_48_HP_FMC (IC37.V28)
FMC1_LA33_P: FMC_connector (J8.g36), FPGA_Banks_47_48_HP_FMC (IC37.V27)
FMC1_PG_C2M: FMC_connector (J8.d1), CPU_LPC1776 (R398.1 R405.1)
FMC1_PG_M2C: FMC_connector (J8.f1), CPU_LPC1776 (R397.1 R406.1)
FMC1_PS#: JTAG_Configuration (R69.2), FMC_connector (J8.h2), CPU_LPC1776 (R396.1 R407.1)
FMC1_TCK: JTAG_Configuration (IC13.16), FMC_connector (J8.d29)
FMC1_TDI: JTAG_Configuration (IC14.1 R68.1), FMC_connector (J8.d30)
FMC1_TDO: JTAG_Configuration (IC14.3), FMC_connector (J8.d31)
FMC1_TMS: JTAG_Configuration (IC13.13), FMC_connector (J8.d33)
FMC1_TRST_n: JTAG_Configuration (R65.1), FMC_connector (J8.d34)
FMC1_VREF_A_M2C: FMC_connector (J8.h1), FPGA_Bank_0_CFG (C210.1 C215.1 IC37.AA30 IC37.V24)
FMC_SCL: FMC_connector (J8.c30), I2C_MUX (IC53.2 IC54.2 R457.2)
FMC_SDA: FMC_connector (J8.c31), I2C_MUX (IC53.1 IC54.1 R456.2)
FPGA_CFG_DOUT: FPGA_Banks_64_65_HR (IC37.K21), FPGA_Bank_0_CFG (R224.1)
FPGA_I2C_SCL: I2C_MUX (B13.1 IC53.19 R475.1), CPU_LPC1776 (R426.1), FPGA_Banks_64_65_HR (IC37.N21)
FPGA_I2C_SDA: I2C_MUX (B12.1 IC53.20 R474.1), CPU_LPC1776 (R427.1), FPGA_Banks_64_65_HR (IC37.M21)
FPGA_RESETn: CPU_LPC1776 (IC51.H12 R436.2), FPGA_Banks_64_65_HR (IC37.H23)
FPGA_STATUS: CPU_LPC1776 (IC51.M5), FPGA_Banks_64_65_HR (IC37.M26)
FPGA_TCK: JTAG_Configuration (IC13.17 R48.1 R61.1), FPGA_Bank_0_CFG (IC37.AC9)
FPGA_TDI: JTAG_Configuration (IC13.18 R60.1), FPGA_Bank_0_CFG (IC37.V9)
FPGA_TDO: JTAG_Configuration (R59.1 R68.2), FPGA_Bank_0_CFG (IC37.U9)
FPGA_TMS: JTAG_Configuration (IC13.11 R49.1 R62.1), FPGA_Bank_0_CFG (IC37.W9)
GA0: AMC_Connector (J5.5), CPU_LPC1776 (D25.1 R390.1 R393.1)
GA1: AMC_Connector (J5.17), CPU_LPC1776 (D26.1 R391.1 R394.1)
GA2: AMC_Connector (J5.26), CPU_LPC1776 (D27.1 R392.1 R395.1)
GT0RX_N: RTM_CON (C227.2), FPGA_Banks_224_225_226_227_228 (IC37.A3)
GT0RX_P: RTM_CON (C228.2), FPGA_Banks_224_225_226_227_228 (IC37.A4)
GT0TX_N: RTM_CON (J10.f10), FPGA_Banks_224_225_226_227_228 (C304.2)
GT0TX_P: RTM_CON (J10.e10), FPGA_Banks_224_225_226_227_228 (C303.2)
GT1RX_N: RTM_CON (C233.2), FPGA_Banks_224_225_226_227_228 (IC37.B1)
GT1RX_P: RTM_CON (C234.2), FPGA_Banks_224_225_226_227_228 (IC37.B2)
GT1TX_N: RTM_CON (J10.f9), FPGA_Banks_224_225_226_227_228 (C306.2)
GT1TX_P: RTM_CON (J10.e9), FPGA_Banks_224_225_226_227_228 (C305.2)
GT2RX_N: RTM_CON (C235.2), FPGA_Banks_224_225_226_227_228 (IC37.D1)
GT2RX_P: RTM_CON (C236.2), FPGA_Banks_224_225_226_227_228 (IC37.D2)
GT2TX_N: RTM_CON (J10.f8), FPGA_Banks_224_225_226_227_228 (C308.2)
GT2TX_P: RTM_CON (J10.e8), FPGA_Banks_224_225_226_227_228 (C307.2)
GT3RX_N: RTM_CON (C239.2), FPGA_Banks_224_225_226_227_228 (IC37.E3)
GT3RX_P: RTM_CON (C240.2), FPGA_Banks_224_225_226_227_228 (IC37.E4)
GT3TX_N: RTM_CON (J10.f7), FPGA_Banks_224_225_226_227_228 (C310.2)
GT3TX_P: RTM_CON (J10.e7), FPGA_Banks_224_225_226_227_228 (C309.2)
GT4RX_N: RTM_CON (C241.2), FPGA_Banks_224_225_226_227_228 (IC37.F1)
GT4RX_P: RTM_CON (C242.2), FPGA_Banks_224_225_226_227_228 (IC37.F2)
GT4TX_N: RTM_CON (J10.f6), FPGA_Banks_224_225_226_227_228 (C302.2)
GT4TX_P: RTM_CON (J10.e6), FPGA_Banks_224_225_226_227_228 (C301.2)
GT5RX_N: RTM_CON (C245.2), FPGA_Banks_224_225_226_227_228 (IC37.H1)
GT5RX_P: RTM_CON (C246.2), FPGA_Banks_224_225_226_227_228 (IC37.H2)
GT5TX_N: RTM_CON (J10.f5), FPGA_Banks_224_225_226_227_228 (C300.2)
GT5TX_P: RTM_CON (J10.e5), FPGA_Banks_224_225_226_227_228 (C299.2)
GT6RX_N: RTM_CON (C248.2), FPGA_Banks_224_225_226_227_228 (IC37.K1)
GT6RX_P: RTM_CON (C249.2), FPGA_Banks_224_225_226_227_228 (IC37.K2)
GT6TX_N: RTM_CON (J10.f4), FPGA_Banks_224_225_226_227_228 (C298.2)
GT6TX_P: RTM_CON (J10.e4), FPGA_Banks_224_225_226_227_228 (C297.2)
GT7RX_N: RTM_CON (C252.2), FPGA_Banks_224_225_226_227_228 (IC37.M1)
GT7RX_P: RTM_CON (C253.2), FPGA_Banks_224_225_226_227_228 (IC37.M2)
GT7TX_N: RTM_CON (J10.f3), FPGA_Banks_224_225_226_227_228 (C296.2)
GT7TX_P: RTM_CON (J10.e3), FPGA_Banks_224_225_226_227_228 (C295.2)
GT8RX_N: RTM_CON (C254.2), FPGA_Banks_224_225_226_227_228 (IC37.P1)
GT8RX_P: RTM_CON (C255.2), FPGA_Banks_224_225_226_227_228 (IC37.P2)
GT8TX_N: RTM_CON (J10.f2), FPGA_Banks_224_225_226_227_228 (C312.1)
GT8TX_P: RTM_CON (J10.e2), FPGA_Banks_224_225_226_227_228 (C311.1)
GT9RX_N: RTM_CON (C263.2), FPGA_Banks_224_225_226_227_228 (IC37.T1)
GT9RX_P: RTM_CON (C264.2), FPGA_Banks_224_225_226_227_228 (IC37.T2)
GT9TX_N: RTM_CON (J10.f1), FPGA_Banks_224_225_226_227_228 (C314.1)
GT9TX_P: RTM_CON (J10.e1), FPGA_Banks_224_225_226_227_228 (C313.1)
GT10RX_N: RTM_CON (C160.2), FPGA_Banks_224_225_226_227_228 (IC37.V1)
GT10RX_P: RTM_CON (C161.2), FPGA_Banks_224_225_226_227_228 (IC37.V2)
GT10TX_N: RTM_CON (J11.f10), FPGA_Banks_224_225_226_227_228 (C316.1)
GT10TX_P: RTM_CON (J11.e10), FPGA_Banks_224_225_226_227_228 (C315.1)
GT11RX_N: RTM_CON (C162.2), FPGA_Banks_224_225_226_227_228 (IC37.Y1)
GT11RX_P: RTM_CON (C163.2), FPGA_Banks_224_225_226_227_228 (IC37.Y2)
GT11TX_N: RTM_CON (J11.f9), FPGA_Banks_224_225_226_227_228 (C318.1)
GT11TX_P: RTM_CON (J11.e9), FPGA_Banks_224_225_226_227_228 (C317.1)
GT12RX_N: RTM_CON (C164.2), FPGA_Banks_224_225_226_227_228 (IC37.AB1)
GT12RX_P: RTM_CON (C165.2), FPGA_Banks_224_225_226_227_228 (IC37.AB2)
GT12TX_N: RTM_CON (J11.f8), FPGA_Banks_224_225_226_227_228 (C326.1)
GT12TX_P: RTM_CON (J11.e8), FPGA_Banks_224_225_226_227_228 (C325.1)
GT13RX_N: RTM_CON (C221.2), FPGA_Banks_224_225_226_227_228 (IC37.AD1)
GT13RX_P: RTM_CON (C222.2), FPGA_Banks_224_225_226_227_228 (IC37.AD2)
GT13TX_N: RTM_CON (J11.f7), FPGA_Banks_224_225_226_227_228 (C324.1)
GT13TX_P: RTM_CON (J11.e7), FPGA_Banks_224_225_226_227_228 (C323.1)
GT14RX_N: RTM_CON (C223.2), FPGA_Banks_224_225_226_227_228 (IC37.AF1)
GT14RX_P: RTM_CON (C224.2), FPGA_Banks_224_225_226_227_228 (IC37.AF2)
GT14TX_N: RTM_CON (J11.f6), FPGA_Banks_224_225_226_227_228 (C322.1)
GT14TX_P: RTM_CON (J11.e6), FPGA_Banks_224_225_226_227_228 (C321.1)
GT15RX_N: RTM_CON (C225.2), FPGA_Banks_224_225_226_227_228 (IC37.AH1)
GT15RX_P: RTM_CON (C226.2), FPGA_Banks_224_225_226_227_228 (IC37.AH2)
GT15TX_N: RTM_CON (J11.f5), FPGA_Banks_224_225_226_227_228 (C320.1)
GT15TX_P: RTM_CON (J11.e5), FPGA_Banks_224_225_226_227_228 (C319.1)
GT16RX_N: RTM_CON (J11.b10), FPGA_Banks_224_225_226_227_228 (C331.2)
GT16RX_P: RTM_CON (J11.a10), FPGA_Banks_224_225_226_227_228 (C330.2)
GT16TX_N: RTM_CON (J11.b8), FPGA_Banks_224_225_226_227_228 (C329.2)
GT16TX_P: RTM_CON (J11.a8), FPGA_Banks_224_225_226_227_228 (C332.2)
GT_CLK0_IN_N: RTM_CON (J10.b1), FPGA_Banks_224_225_226_227_228 (IC37.V5)
GT_CLK0_IN_P: RTM_CON (J10.a1), FPGA_Banks_224_225_226_227_228 (IC37.V6)
Helper_CLK_N: SI5324_CDR_WR_oscillators (C346.2 R297.1 R375.2), DDMTD (C672.1)
Helper_CLK_P: SI5324_CDR_WR_oscillators (C344.2 R296.1 R379.1 R386.2), DDMTD (C671.1)
Helper_DCXO_N: SI5324_CDR_WR_oscillators (R297.2), FPGA_Bank_66_HP (IC37.G11 R349.2)
Helper_DCXO_OE: SI5324_CDR_WR_oscillators (R383.2 R385.2), FPGA_Banks_64_65_HR (IC37.N26)
Helper_DCXO_P: SI5324_CDR_WR_oscillators (R296.2), FPGA_Bank_66_HP (IC37.H11 R348.2)
Helper_DCXO_SCL: SI5324_CDR_WR_oscillators (OSC5.8 R365.1 TP6.1), FPGA_Banks_64_65_HR (IC37.M24)
Helper_DCXO_SDA: SI5324_CDR_WR_oscillators (OSC5.7 R364.1 TP5.1), FPGA_Banks_64_65_HR (IC37.K23)
I2C_MUX_ADDR1: I2C_MUX (R463.1 R472.1), CPU_LPC1776 (IC51.L1)
I2C_MUX_ADDR2: I2C_MUX (R462.1 R471.1), CPU_LPC1776 (IC51.M2)
I2C_SW_FPGA_RESETn: I2C_MUX (IC53.24 R478.2), FPGA_Banks_64_65_HR (IC37.M25)
IO_RX_P17: FPGA_Banks_64_65_HR (IC37.AP8), M-LVDS_PHY (IC20.25 R100.1)
IO_RX_P18: FPGA_Banks_64_65_HR (IC37.AK10), M-LVDS_PHY (IC20.32 R98.1)
IO_RX_P19: FPGA_Banks_64_65_HR (IC37.AL9), M-LVDS_PHY (IC21.25 R104.1)
IO_RX_P20: FPGA_Banks_64_65_HR (IC37.AN9), M-LVDS_PHY (IC21.32 R102.1)
IO_TX_P17: FPGA_Banks_64_65_HR (IC37.AM9), M-LVDS_PHY (IC20.28 R99.1)
IO_TX_P18: FPGA_Banks_64_65_HR (IC37.AJ9), M-LVDS_PHY (IC20.35 R97.1)
IO_TX_P19: FPGA_Banks_64_65_HR (IC37.AJ8), M-LVDS_PHY (IC21.28 R103.1)
IO_TX_P20: FPGA_Banks_64_65_HR (IC37.AN8), M-LVDS_PHY (IC21.35 R101.1)
IPMB_SCL: AMC_Connector (J5.56), CPU_LPC1776 (D24.1 IC51.M1 R403.2)
IPMB_SDA: AMC_Connector (J5.71), CPU_LPC1776 (D23.1 IC51.L3 R402.2)
ISP_RSTn: USB_SERIAL_QUAD (T1.3), CPU_LPC1776_SUP_PROG (SW2.1)
LPC_ISP_SWn: CPU_LPC1776 (IC51.M13), CPU_LPC1776_SUP_PROG (SW2.7)
LPC_ISPn: USB_SERIAL_QUAD (IC8.4 R518.1), CPU_LPC1776_SUP_PROG (SW2.2)
LTM_1V5_OUT: PWR_DC_DC_EXAR (C577.2 L31.1 L35.1 MOD1.22), QUAD_BUCK (5 pins)
LTM_1V8_OUT: PWR_DC_DC_EXAR (C575.2 L29.1 L33.1 MOD1.18), QUAD_BUCK (5 pins)
LTM_1V_OUT: PWR_DC_DC_EXAR (5 pins), QUAD_BUCK (5 pins)
LTM_3V3_OUT: PWR_DC_DC_EXAR (C573.2 L28.1 L34.1 MOD1.13), QUAD_BUCK (5 pins)
LTM_PGOOD: QUAD_BUCK (5 pins), CPU_LPC1776 (IC51.B8)
LVDS0_CC_N: RTM_CON (J11.b4), FPGA_Bank_66_HP (IC37.F10)
LVDS0_CC_P: RTM_CON (J11.a4), FPGA_Bank_66_HP (IC37.G10)
LVDS1_CC_N: RTM_CON (J11.b7), FPGA_Bank_66_HP (IC37.F9)
LVDS1_CC_P: RTM_CON (J11.a7), FPGA_Bank_66_HP (IC37.G9)
LVDS2_N: RTM_CON (J11.b6), FPGA_Bank_66_HP (IC37.E8)
LVDS2_P: RTM_CON (J11.a6), FPGA_Bank_66_HP (IC37.F8)
LVDS3_N: RTM_CON (J11.b5), FPGA_Bank_66_HP (IC37.H9)
LVDS3_P: RTM_CON (J11.a5), FPGA_Bank_66_HP (IC37.J9)
LVDS4_N: RTM_CON (J11.b9), FPGA_Bank_66_HP (IC37.D11)
LVDS4_P: RTM_CON (J11.a9), FPGA_Bank_66_HP (IC37.E11)
LVDS5_N: RTM_CON (J11.d3), FPGA_Bank_66_HP (IC37.K12)
LVDS5_P: RTM_CON (J11.c3), FPGA_Bank_66_HP (IC37.L12)
LVDS6_N: RTM_CON (J11.f3), FPGA_Bank_66_HP (IC37.K13)
LVDS6_P: RTM_CON (J11.e3), FPGA_Bank_66_HP (IC37.L13)
LVDS7_N: RTM_CON (J10.b3), FPGA_Bank_66_HP (IC37.B11)
LVDS7_P: RTM_CON (J10.a3), FPGA_Bank_66_HP (IC37.C11)
LVDS8_N: RTM_CON (J10.b6), FPGA_Bank_66_HP (IC37.B12)
LVDS8_P: RTM_CON (J10.a6), FPGA_Bank_66_HP (IC37.C12)
LVDS9_N: RTM_CON (J10.b4), FPGA_Bank_66_HP (IC37.A9)
LVDS9_P: RTM_CON (J10.a4), FPGA_Bank_66_HP (IC37.B9)
LVDS10_N: RTM_CON (J10.b2), FPGA_Bank_66_HP (IC37.C8)
LVDS10_P: RTM_CON (J10.a2), FPGA_Bank_66_HP (IC37.D8)
LVDS11_N: RTM_CON (J11.b3), FPGA_Bank_66_HP (IC37.K8)
LVDS11_P: RTM_CON (J11.a3), FPGA_Bank_66_HP (IC37.L8)
LVDS12_N: RTM_CON (R196.2), FPGA_Bank_66_HP (IC37.D10)
LVDS12_P: RTM_CON (R197.2), FPGA_Bank_66_HP (IC37.E10)
LVDS13_N: RTM_CON (R198.2), FPGA_Bank_66_HP (IC37.C9)
LVDS13_P: RTM_CON (R199.2), FPGA_Bank_66_HP (IC37.D9)
LVDS14_N: RTM_CON (R200.2), FPGA_Bank_66_HP (IC37.E13)
LVDS14_P: RTM_CON (R201.2), FPGA_Bank_66_HP (IC37.F13)
LVDS15_N: RTM_CON (R202.2), FPGA_Bank_66_HP (IC37.A12)
LVDS15_P: RTM_CON (R265.2), FPGA_Bank_66_HP (IC37.A13)
LVDS16_N: RTM_CON (R266.2), FPGA_Bank_66_HP (IC37.J11)
LVDS16_P: RTM_CON (R267.2), FPGA_Bank_66_HP (IC37.K11)
LVDS17_N: RTM_CON (R268.2), FPGA_Bank_66_HP (IC37.C13)
LVDS17_P: RTM_CON (R273.2), FPGA_Bank_66_HP (IC37.D13)
LVDS18_N: RTM_CON (R274.2), FPGA_Banks_47_48_HP_FMC (IC37.AG30)
LVDS18_P: RTM_CON (R275.2), FPGA_Banks_47_48_HP_FMC (IC37.AF30)
LVDS19_N: RTM_CON (R276.2), FPGA_Banks_47_48_HP_FMC (IC37.AB27)
LVDS19_P: RTM_CON (R277.2), FPGA_Banks_47_48_HP_FMC (IC37.AA27)
LVDS20_N: RTM_CON (R278.2), FPGA_Banks_47_48_HP_FMC (IC37.AC27)
LVDS20_P: RTM_CON (R279.2), FPGA_Banks_47_48_HP_FMC (IC37.AC26)
LVDS21_N: RTM_CON (R280.2), FPGA_Banks_47_48_HP_FMC (IC37.AD26)
LVDS21_P: RTM_CON (R285.2), FPGA_Banks_47_48_HP_FMC (IC37.AD25)
LVDS22_N: RTM_CON (R286.2), FPGA_Banks_47_48_HP_FMC (IC37.AC24)
LVDS22_P: RTM_CON (R287.2), FPGA_Banks_47_48_HP_FMC (IC37.AB24)
LVDS23_N: RTM_CON (R288.2), FPGA_Banks_47_48_HP_FMC (IC37.Y27)
LVDS23_P: RTM_CON (R293.2), FPGA_Banks_47_48_HP_FMC (IC37.Y26)
LVDS24_N: RTM_CON (R188.2), FPGA_Banks_47_48_HP_FMC (IC37.AF28)
LVDS24_P: RTM_CON (R189.2), FPGA_Banks_47_48_HP_FMC (IC37.AE28)
LVDS25_N: RTM_CON (R190.2), FPGA_Banks_47_48_HP_FMC (IC37.AD28)
LVDS25_P: RTM_CON (R191.2), FPGA_Banks_47_48_HP_FMC (IC37.AC28)
LVDS26_CC_N: RTM_CON (R194.2), FPGA_Banks_47_48_HP_FMC (IC37.AD31)
LVDS26_CC_P: RTM_CON (R195.2), FPGA_Banks_47_48_HP_FMC (IC37.AD30)
LVDS27_N: RTM_CON (R192.2), FPGA_Banks_47_48_HP_FMC (IC37.AE30)
LVDS27_P: RTM_CON (R193.2), FPGA_Banks_47_48_HP_FMC (IC37.AD29)
LVDS28_N: RTM_CON (J11.f4), FPGA_Bank_66_HP (IC37.H8)
LVDS28_P: RTM_CON (J11.e4), FPGA_Bank_66_HP (IC37.J8)
LVDS29_N: RTM_CON (J11.d4), FPGA_Bank_66_HP (IC37.H13)
LVDS29_P: RTM_CON (J11.c4), FPGA_Bank_66_HP (IC37.J13)
LVDS30_N: RTM_CON (J10.b5), FPGA_Bank_66_HP (IC37.A10)
LVDS30_P: RTM_CON (J10.a5), FPGA_Bank_66_HP (IC37.B10)
Main_DCXO_N: SI5324_CDR_WR_oscillators (C277.2 C371.2 IC44.2), DDMTD (C670.1)
Main_DCXO_OE: SI5324_CDR_WR_oscillators (R382.2 R384.2), FPGA_Banks_64_65_HR (IC37.P25)
Main_DCXO_P: SI5324_CDR_WR_oscillators (C276.2 IC44.1), DDMTD (C669.1)
Main_DCXO_SCL: SI5324_CDR_WR_oscillators (OSC4.8 R362.1 TP4.1), FPGA_Banks_64_65_HR (IC37.L25)
Main_DCXO_SDA: SI5324_CDR_WR_oscillators (OSC4.7 R361.1 TP3.1), FPGA_Banks_64_65_HR (IC37.N27)
MDIO_INTn: ETH_PHY_RGMII (R214.1 R215.2), FPGA_Banks_64_65_HR (IC37.AG10)
MGT_CDR_CLK_N: DDMTD (C565.1 R347.2), FPGA_Banks_224_225_226_227_228 (IC37.AD5)
MGT_CDR_CLK_P: DDMTD (C449.1 R347.1), FPGA_Banks_224_225_226_227_228 (IC37.AD6)
MLVDS_FSEN: FPGA_Banks_64_65_HR (IC37.AE8), M-LVDS_PHY (8 pins)
MMC_CONS_PROG_RxD: USB_SERIAL_QUAD (IC8.2), CPU_LPC1776 (IC51.A3)
MMC_CONS_PROG_TxD: USB_SERIAL_QUAD (IC8.3), CPU_LPC1776 (IC51.D5)
MMC_FPGA_DONE: CPU_LPC1776 (IC51.B11), FPGA_Bank_0_CFG (R243.2)
MMC_FPGA_INIT_B: CPU_LPC1776 (IC51.J5), FPGA_Bank_0_CFG (R244.2)
MMC_FPGA_PROGRAM_B: CPU_LPC1776 (IC51.A11), FPGA_Bank_0_CFG (R242.2)
MMC_MISO1: CPU_LPC1776 (IC51.C12), FPGA_Banks_64_65_HR (IC37.H26)
MMC_MOSI1: CPU_LPC1776 (IC51.A13), FPGA_Banks_64_65_HR (IC37.J24)
MMC_SCK1: CPU_LPC1776 (IC51.B12), FPGA_Banks_64_65_HR (IC37.H24)
MMC_SCL: I2C_MUX (B15.1 IC54.19 R477.1), CPU_LPC1776 (IC51.N11)
MMC_SDA: I2C_MUX (B14.1 IC54.20 R476.1), CPU_LPC1776 (IC51.M10)
MMC_SSEL1: CPU_LPC1776 (IC51.D11), FPGA_Banks_64_65_HR (IC37.J26)
MMC_TCK: JTAG_Configuration (IC5.11), CPU_LPC1776_SUP_PROG (R444.2)
MMC_TDI: JTAG_Configuration (IC5.2), CPU_LPC1776_SUP_PROG (R442.2)
MMC_TDO: JTAG_Configuration (IC5.5), CPU_LPC1776_SUP_PROG (R443.2)
MMC_TMS: JTAG_Configuration (IC5.14), CPU_LPC1776_SUP_PROG (R445.2)
MMC_TRSTn: JTAG_Configuration (R63.1), CPU_LPC1776_SUP_PROG (R441.2)
NetD6_2: JTAG_Configuration (D6.2), CPU_LPC1776 (IC51.K13)
NetD7_2: JTAG_Configuration (D7.2), CPU_LPC1776 (IC51.D9)
NetD28_1: JTAG_Configuration (R70.2), RTM_CON (J11.c1), CPU_LPC1776 (D28.1 R423.1 R424.1)
NetIC1_1: SI5324_CDR_WR_oscillators (IC1.1), CPU_LPC1776 (IC51.B6)
NetIC16_1: POWER_Management (IC16.1 R87.1), CPU_LPC1776 (IC51.N4)
NetIC45_3: Thermometers (6 pins), CPU_LPC1776 (IC51.F11)
NetIC51_E5: I2C_MUX (IC54.24), CPU_LPC1776 (IC51.E5 R425.2)
P0V95_PG: PWR_DC_DC_EXAR (IC58.9 MOD1.8 R490.1), CPU_LPC1776 (IC51.C9)
P0V95I_PG: PWR_DC_DC_EXAR (R505.2), PWR_0V9_20A (IC60.3 R512.1), CPU_LPC1776 (IC51.P5)
P1V2_PG: PWR_DC_DC_EXAR (IC59.9 MOD1.7 R491.1), CPU_LPC1776 (IC51.L5)
P3V3_FMC_PGOOD: PWR_DC_DC_EXAR (IC34.7 R496.2), CPU_LPC1776 (IC51.B10)
PGOOD_P5V0: PWR_DC_DC_EXAR (IC24.7 R495.2), CPU_LPC1776 (IC51.M6)
PHY_RESETn: ETH_PHY_RGMII (IC36.16 R40.1), FPGA_Banks_64_65_HR (IC37.T25)
PM_SCL: POWER_Management (IC55.5 IC56.5), PWR_DC_DC_EXAR (D32.1 MOD1.11 W11.2), I2C_MUX (IC53.13 IC54.13 R466.2)
PM_SDA: POWER_Management (IC55.6 IC56.6), PWR_DC_DC_EXAR (D33.1 MOD1.10 W11.3), I2C_MUX (IC53.12 IC54.12 R465.2)
PRI_UART_RxD: USB_SERIAL_QUAD (R14.1), FPGA_Banks_64_65_HR (IC37.AL8)
PRI_UART_TxD: USB_SERIAL_QUAD (R13.1), FPGA_Banks_64_65_HR (IC37.AK8)
QSPI1_CS_B: FPGA_Banks_64_65_HR (IC37.G26), FPGA_Bank_0_CFG (IC3.7 R222.1)
QSPI1_IO0: FPGA_Banks_64_65_HR (IC37.M20), FPGA_Bank_0_CFG (IC3.15)
QSPI1_IO1: FPGA_Banks_64_65_HR (IC37.L20), FPGA_Bank_0_CFG (IC3.8)
QSPI1_IO2: FPGA_Banks_64_65_HR (IC37.R21), FPGA_Bank_0_CFG (IC3.9 R234.1)
QSPI1_IO3: FPGA_Banks_64_65_HR (IC37.R22), FPGA_Bank_0_CFG (IC3.1 R221.1)
RE_DE_RX_P17: FPGA_Banks_64_65_HR (IC37.AH8), M-LVDS_PHY (IC20.12 IC20.21)
RE_DE_RX_P18: FPGA_Banks_64_65_HR (IC37.AD9), M-LVDS_PHY (IC20.5 IC20.42)
RE_DE_RX_P19: FPGA_Banks_64_65_HR (IC37.AD8), M-LVDS_PHY (IC21.12 IC21.21)
RE_DE_RX_P20: FPGA_Banks_64_65_HR (IC37.AD10), M-LVDS_PHY (IC21.5 IC21.42)
RE_DE_TX_P17: FPGA_Banks_64_65_HR (IC37.AP9), M-LVDS_PHY (IC20.8 IC20.19)
RE_DE_TX_P18: FPGA_Banks_64_65_HR (IC37.AL10), M-LVDS_PHY (IC20.1 IC20.40)
RE_DE_TX_P19: FPGA_Banks_64_65_HR (IC37.AM10), M-LVDS_PHY (IC21.8 IC21.19)
RE_DE_TX_P20: FPGA_Banks_64_65_HR (IC37.AH9), M-LVDS_PHY (IC21.1 IC21.40)
REC_CLOCK_C_N: SI5324_CDR_WR_oscillators (C340.2 R356.1), DDMTD (C679.1), FPGA_Banks_47_48_HP_FMC (IC37.AF27)
REC_CLOCK_C_P: SI5324_CDR_WR_oscillators (C339.2 R356.2), DDMTD (C678.1), FPGA_Banks_47_48_HP_FMC (IC37.AE27)
RF_OUT: Sayma_AMC (J3.1), SI5324_CDR_WR_oscillators (C364.2)
RGMII_MDC: ETH_PHY_RGMII (IC36.7), FPGA_Banks_64_65_HR (IC37.T27)
RGMII_MDIO: ETH_PHY_RGMII (IC36.8 R211.1), FPGA_Banks_64_65_HR (IC37.R27)
RGMII_RX_CLK: ETH_PHY_RGMII (R209.2), FPGA_Banks_64_65_HR (IC37.P24)
RGMII_RX_CTL: ETH_PHY_RGMII (R210.2), FPGA_Banks_64_65_HR (IC37.T24)
RGMII_RXD0: ETH_PHY_RGMII (R208.2), FPGA_Banks_64_65_HR (IC37.R23)
RGMII_RXD1: ETH_PHY_RGMII (R207.2), FPGA_Banks_64_65_HR (IC37.P23)
RGMII_RXD2: ETH_PHY_RGMII (R206.2), FPGA_Banks_64_65_HR (IC37.R25)
RGMII_RXD3: ETH_PHY_RGMII (R205.2), FPGA_Banks_64_65_HR (IC37.R26)
RGMII_TX_CLK: ETH_PHY_RGMII (IC36.53), FPGA_Banks_64_65_HR (IC37.M22)
RGMII_TX_CTL: ETH_PHY_RGMII (IC36.56), FPGA_Banks_64_65_HR (IC37.N22)
RGMII_TXD0: ETH_PHY_RGMII (IC36.50), FPGA_Banks_64_65_HR (IC37.K20)
RGMII_TXD1: ETH_PHY_RGMII (IC36.51), FPGA_Banks_64_65_HR (IC37.K22)
RGMII_TXD2: ETH_PHY_RGMII (IC36.54), FPGA_Banks_64_65_HR (IC37.P20)
RGMII_TXD3: ETH_PHY_RGMII (IC36.55), FPGA_Banks_64_65_HR (IC37.P21)
RTM_FPGA_CCLK: RTM_CON (J10.a10), FPGA_Banks_64_65_HR (R308.2), FPGA_Bank_0_CFG (R223.2)
RTM_FPGA_DIN: RTM_CON (J10.b10), FPGA_Banks_64_65_HR (R309.2), FPGA_Bank_0_CFG (R224.2)
RTM_FPGA_DONE: RTM_CON (J10.a9), FPGA_Banks_64_65_HR (R310.2), FPGA_Bank_0_CFG (R225.2)
RTM_FPGA_INIT_B: RTM_CON (J10.b8), FPGA_Banks_64_65_HR (R311.2), FPGA_Bank_0_CFG (R226.2)
RTM_FPGA_PROGRAM_B: RTM_CON (J10.b9), FPGA_Banks_64_65_HR (R312.2), FPGA_Bank_0_CFG (R227.2)
RTM_SCL: RTM_CON (J11.d2), I2C_MUX (IC53.17 IC54.17 R470.2)
RTM_SDA: RTM_CON (J11.d1), I2C_MUX (IC53.16 IC54.16 R469.2)
RTM_TCK: JTAG_Configuration (IC13.15), RTM_CON (J11.e1)
RTM_TDI: JTAG_Configuration (IC14.4 IC15.1), RTM_CON (J11.e2)
RTM_TDO: JTAG_Configuration (IC15.3), RTM_CON (J11.f1)
RTM_TMS: JTAG_Configuration (IC13.12), RTM_CON (J11.f2)
RTM_UART_Rx: RTM_CON (J10.b7), FPGA_Banks_64_65_HR (IC37.H27)
RTM_UART_Tx: RTM_CON (J10.a7), FPGA_Banks_64_65_HR (IC37.G27)
Rx0_N: AMC_Connector (J5.15), ETH_PHY_RGMII (C167.1 C183.1 J14.5)
Rx0_P: AMC_Connector (J5.14), ETH_PHY_RGMII (C166.1 C182.1 J14.6)
Rx4_N: AMC_Connector (J5.48), FPGA_Banks_224_225_226_227_228 (IC37.AK1 J16.5)
Rx4_P: AMC_Connector (J5.47), FPGA_Banks_224_225_226_227_228 (IC37.AK2 J16.6)
Rx5_N: AMC_Connector (J5.54), FPGA_Banks_44_45_46_DDR64 (C230.2), FPGA_Banks_224_225_226_227_228 (C328.2 J17.5)
Rx5_P: AMC_Connector (J5.53), FPGA_Banks_44_45_46_DDR64 (C229.2), FPGA_Banks_224_225_226_227_228 (C327.2 J17.6)
Rx17_N: AMC_Connector (J5.141), M-LVDS_PHY (IC20.14)
Rx17_P: AMC_Connector (J5.142), M-LVDS_PHY (IC20.13)
Rx18_N: AMC_Connector (J5.147), M-LVDS_PHY (IC20.4)
Rx18_P: AMC_Connector (J5.148), M-LVDS_PHY (IC20.3)
Rx19_N: AMC_Connector (J5.153), M-LVDS_PHY (IC21.14)
Rx19_P: AMC_Connector (J5.154), M-LVDS_PHY (IC21.13)
Rx20_N: AMC_Connector (J5.159), M-LVDS_PHY (IC21.4)
Rx20_P: AMC_Connector (J5.160), M-LVDS_PHY (IC21.3)
SCL2: I2C_MUX (IC53.6 IC54.6 R453.2), SFP (R185B.2)
SCL3: SFP (R185A.2), I2C_MUX (IC53.8 IC54.8 R459.2)
SCL4: SI5324_CDR_WR_oscillators (IC43.22 TP2.1), I2C_MUX (IC53.11 IC54.11 R461.2)
SCL6: I2C_MUX (IC53.15 IC54.15 R468.2), Thermometers (6 pins)
SDA2: I2C_MUX (IC53.5 IC54.5 R452.2), SFP (R184B.2)
SDA3: SFP (R184A.2), I2C_MUX (IC53.7 IC54.7 R458.2)
SDA4: SI5324_CDR_WR_oscillators (IC43.23 TP1.1), I2C_MUX (IC53.10 IC54.10 R460.2)
SDA6: I2C_MUX (IC53.14 IC54.14 R467.2), Thermometers (6 pins)
SDRAM_PGOOD: SDRAM_DDR3_4x16 (IC28.9), SDRAM_DDR3_2x16 (IC29.9), CPU_LPC1776 (IC51.E14)
SFP0RX_N: SFP (J13B.12), FPGA_Banks_224_225_226_227_228 (IC37.AP1)
SFP0RX_P: SFP (J13B.13), FPGA_Banks_224_225_226_227_228 (IC37.AP2)
SFP0TX_N: SFP (J13B.19), FPGA_Banks_224_225_226_227_228 (IC37.AN3)
SFP0TX_P: SFP (J13B.18), FPGA_Banks_224_225_226_227_228 (IC37.AN4)
SFP1_LED1: SFP (R176B.2), FPGA_Banks_64_65_HR (IC37.AG9)
SFP1_LED2: SFP (R177B.2), FPGA_Banks_64_65_HR (IC37.AJ10)
SFP1_LOS: SFP (IC32B.7), FPGA_Banks_64_65_HR (IC37.AM11)
SFP1_MOD_DEF0: SFP (IC32B.5), FPGA_Banks_64_65_HR (IC37.AN11)
SFP1_MOD_DEF1: SFP (R181B.2), FPGA_Banks_64_65_HR (IC37.AN13)
SFP1_MOD_DEF2: SFP (R180B.2), FPGA_Banks_64_65_HR (IC37.AP13)
SFP1_RATE_SELECT: SFP (IC32B.4 R183B.1), FPGA_Banks_64_65_HR (IC37.AK11)
SFP1_TX_DISABLE: SFP (IC32B.2 R182B.1), FPGA_Banks_64_65_HR (IC37.AP11)
SFP1_TX_FAULT: SFP (IC32B.9), FPGA_Banks_64_65_HR (IC37.AP10)
SFP1RX_N: SFP (J13A.12), FPGA_Banks_224_225_226_227_228 (C349.2)
SFP1RX_P: SFP (J13A.13), FPGA_Banks_224_225_226_227_228 (C352.2)
SFP1TX_N: SFP (J13A.19), FPGA_Banks_224_225_226_227_228 (C347.2)
SFP1TX_P: SFP (J13A.18), FPGA_Banks_224_225_226_227_228 (C348.2)
SFP2_LED1: SFP (R176A.2), FPGA_Banks_64_65_HR (IC37.AJ13)
SFP2_LED2: SFP (R177A.2), FPGA_Banks_64_65_HR (IC37.AE13)
SFP2_LOS: SFP (IC32A.7), FPGA_Banks_64_65_HR (IC37.AF13)
SFP2_MOD_DEF0: SFP (IC32A.5), FPGA_Banks_64_65_HR (IC37.AK13)
SFP2_MOD_DEF1: SFP (R181A.2), FPGA_Banks_64_65_HR (IC37.AL13)
SFP2_MOD_DEF2: SFP (R180A.2), FPGA_Banks_64_65_HR (IC37.AK12)